# Altium schematic sheet AuxhalfH.SchDoc
size A3; DocumentNumber: 4; SheetNumber: 4; SheetTotal: 8
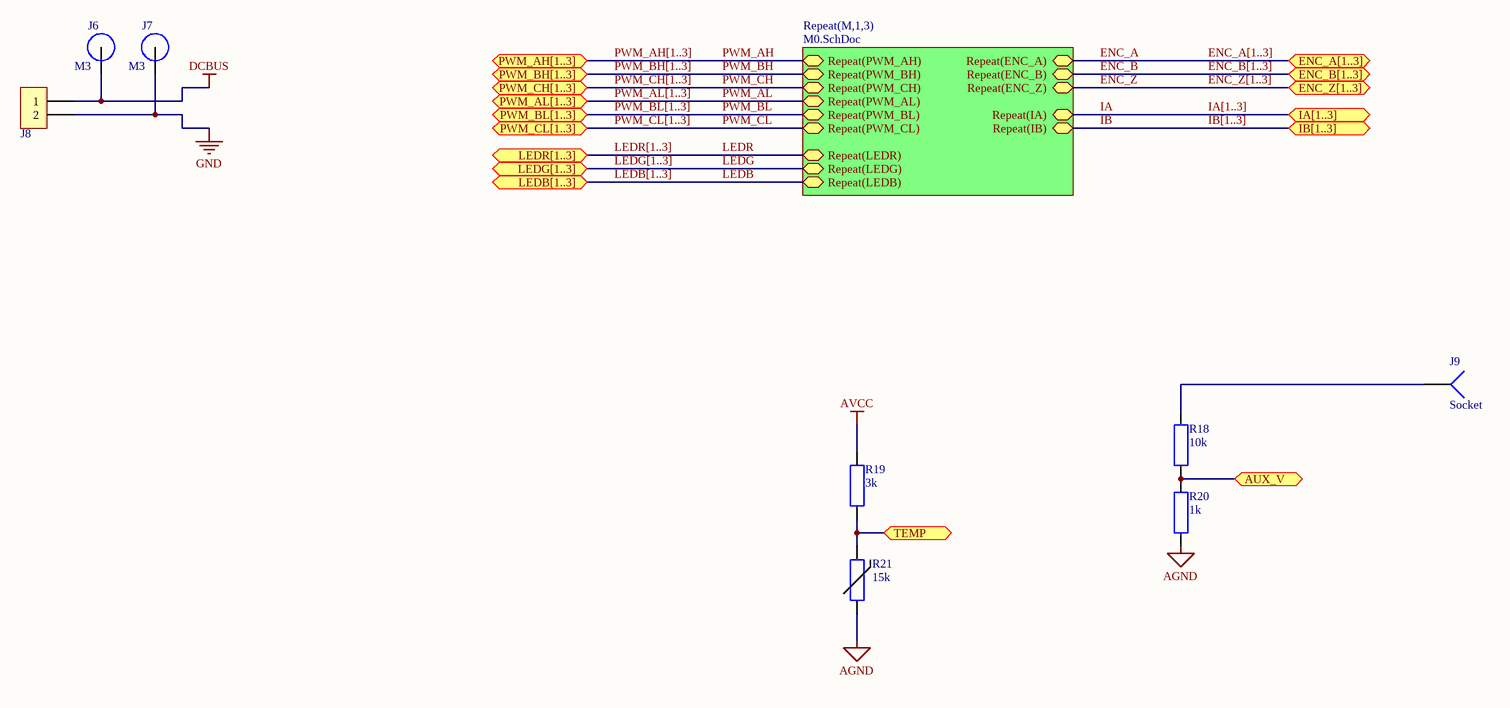
[diagram p0: AuxhalfH.SchDoc]

## Parts
J6  M3  [M3 Spade Hole]
J7  M3  [M3 Spade Hole]
J8  MC000232  [MC000232]  (value not drawn)
J9  Socket  [PIN1]
R18  value 10k  [RESC1608X06L]  (hidden comment: MCMR06X1002FTL)
R19  value 3k  [RESC1608X55N]  (hidden comment: MCMR06X3001FTL)
R20  value 1k  [RESC1608X55N]  (hidden comment: MCMR06X1001FTL)
R21  value 15k  [RESC1608X06L]  (hidden comment: NTCS0603E3153JMT)

## Sub-sheets
Repeat(M,1,3) = M0.SchDoc: Repeat(PWM_CH), Repeat(PWM_BH), Repeat(ENC_A), Repeat(PWM_AH), Repeat(ENC_B), Repeat(PWM_CL), Repeat(ENC_Z), Repeat(PWM_BL), Repeat(PWM_AL), Repeat(IA), Repeat(IB), Repeat(LEDR), Repeat(LEDG), Repeat(LEDB)

## Ports
AUX_V, ENC_A[1..3], ENC_B[1..3], ENC_Z[1..3], IA[1..3], IB[1..3], LEDB[1..3], LEDG[1..3], LEDR[1..3], PWM_AH[1..3], PWM_AL[1..3], PWM_BH[1..3], PWM_BL[1..3], PWM_CH[1..3], PWM_CL[1..3], TEMP

## Nets
AGND: R20.1 R21.1
AVCC: R19.2
DCBUS: J6.1 J8.1
GND: J7.1 J8.2
AUX_V: R18.1 R20.2 ; port AUX_V
ENC_A: sheet Repeat(M,1,3)/Repeat(ENC_A)
ENC_B: sheet Repeat(M,1,3)/Repeat(ENC_B)
ENC_Z: sheet Repeat(M,1,3)/Repeat(ENC_Z)
IA: sheet Repeat(M,1,3)/Repeat(IA)
IB: sheet Repeat(M,1,3)/Repeat(IB)
LEDB: sheet Repeat(M,1,3)/Repeat(LEDB)
LEDG: sheet Repeat(M,1,3)/Repeat(LEDG)
LEDR: sheet Repeat(M,1,3)/Repeat(LEDR)
PWM_AH: sheet Repeat(M,1,3)/Repeat(PWM_AH)
PWM_AL: sheet Repeat(M,1,3)/Repeat(PWM_AL)
PWM_BH: sheet Repeat(M,1,3)/Repeat(PWM_BH)
PWM_BL: sheet Repeat(M,1,3)/Repeat(PWM_BL)
PWM_CH: sheet Repeat(M,1,3)/Repeat(PWM_CH)
PWM_CL: sheet Repeat(M,1,3)/Repeat(PWM_CL)
TEMP: R19.1 R21.2 ; port TEMP
NetJ9_1: J9.1 R18.2

## Buses and harness runs
bus ENC_A[1..3] = port ENC_A[1..3]
bus ENC_B[1..3] = port ENC_B[1..3]
bus ENC_Z[1..3] = port ENC_Z[1..3]
bus IA[1..3] = port IA[1..3]
bus IB[1..3] = port IB[1..3]
bus LEDB[1..3] = port LEDB[1..3]
bus LEDG[1..3] = port LEDG[1..3]
bus LEDR[1..3] = port LEDR[1..3]
bus PWM_AH[1..3] = port PWM_AH[1..3]
bus PWM_AL[1..3] = port PWM_AL[1..3]
bus PWM_BH[1..3] = port PWM_BH[1..3]
bus PWM_BL[1..3] = port PWM_BL[1..3]
bus PWM_CH[1..3] = port PWM_CH[1..3]
bus PWM_CL[1..3] = port PWM_CL[1..3]

## Library data of the parts
J6 J7 = M3 Spade Terminal
J8 = MC000232: TERMINAL BLOCK, WIRE TO BRD, 2POS, 6AWG; Supplier 1: Farnell; Supplier Part Number 1: 2008224
R18 = MCMR06X1002FTL: Resistor, 10k, 0603; Supplier 1: Farnell; Supplier Part Number 1: 2073349; Supplier 2: Farnell; Supplier Part Number 2: 2073349RL
R19 = MCMR06X3001FTL: RESISTOR, 0603, 3K, 1%, ANTI SULFUR; Supplier 1: Farnell; Supplier Part Number 1: 2073461; Supplier 2: Farnell; Supplier Part Number 2: 2073461RL
R20 = MCMR06X1001FTL: RESISTOR, CERAMIC, 1K, 0.1W, 1%; Supplier 1: Farnell; Supplier Part Number 1: 2073348; Supplier 2: Farnell; Supplier Part Number 2: 2073348RL
R21 = NTCS0603E3153JMT: THERMISTOR, 15K, 5%, SMD, NTC
J9 = Socket: LatestRevisionDate: 17-Jul-2002; LatestRevisionNote: Re-released for DXP Platform.; Publisher: Altium Limited